# Altium schematic sheet DSP.SchDoc
size 400 x 260 mm; SheetNumber: 1; SheetTotal: 6
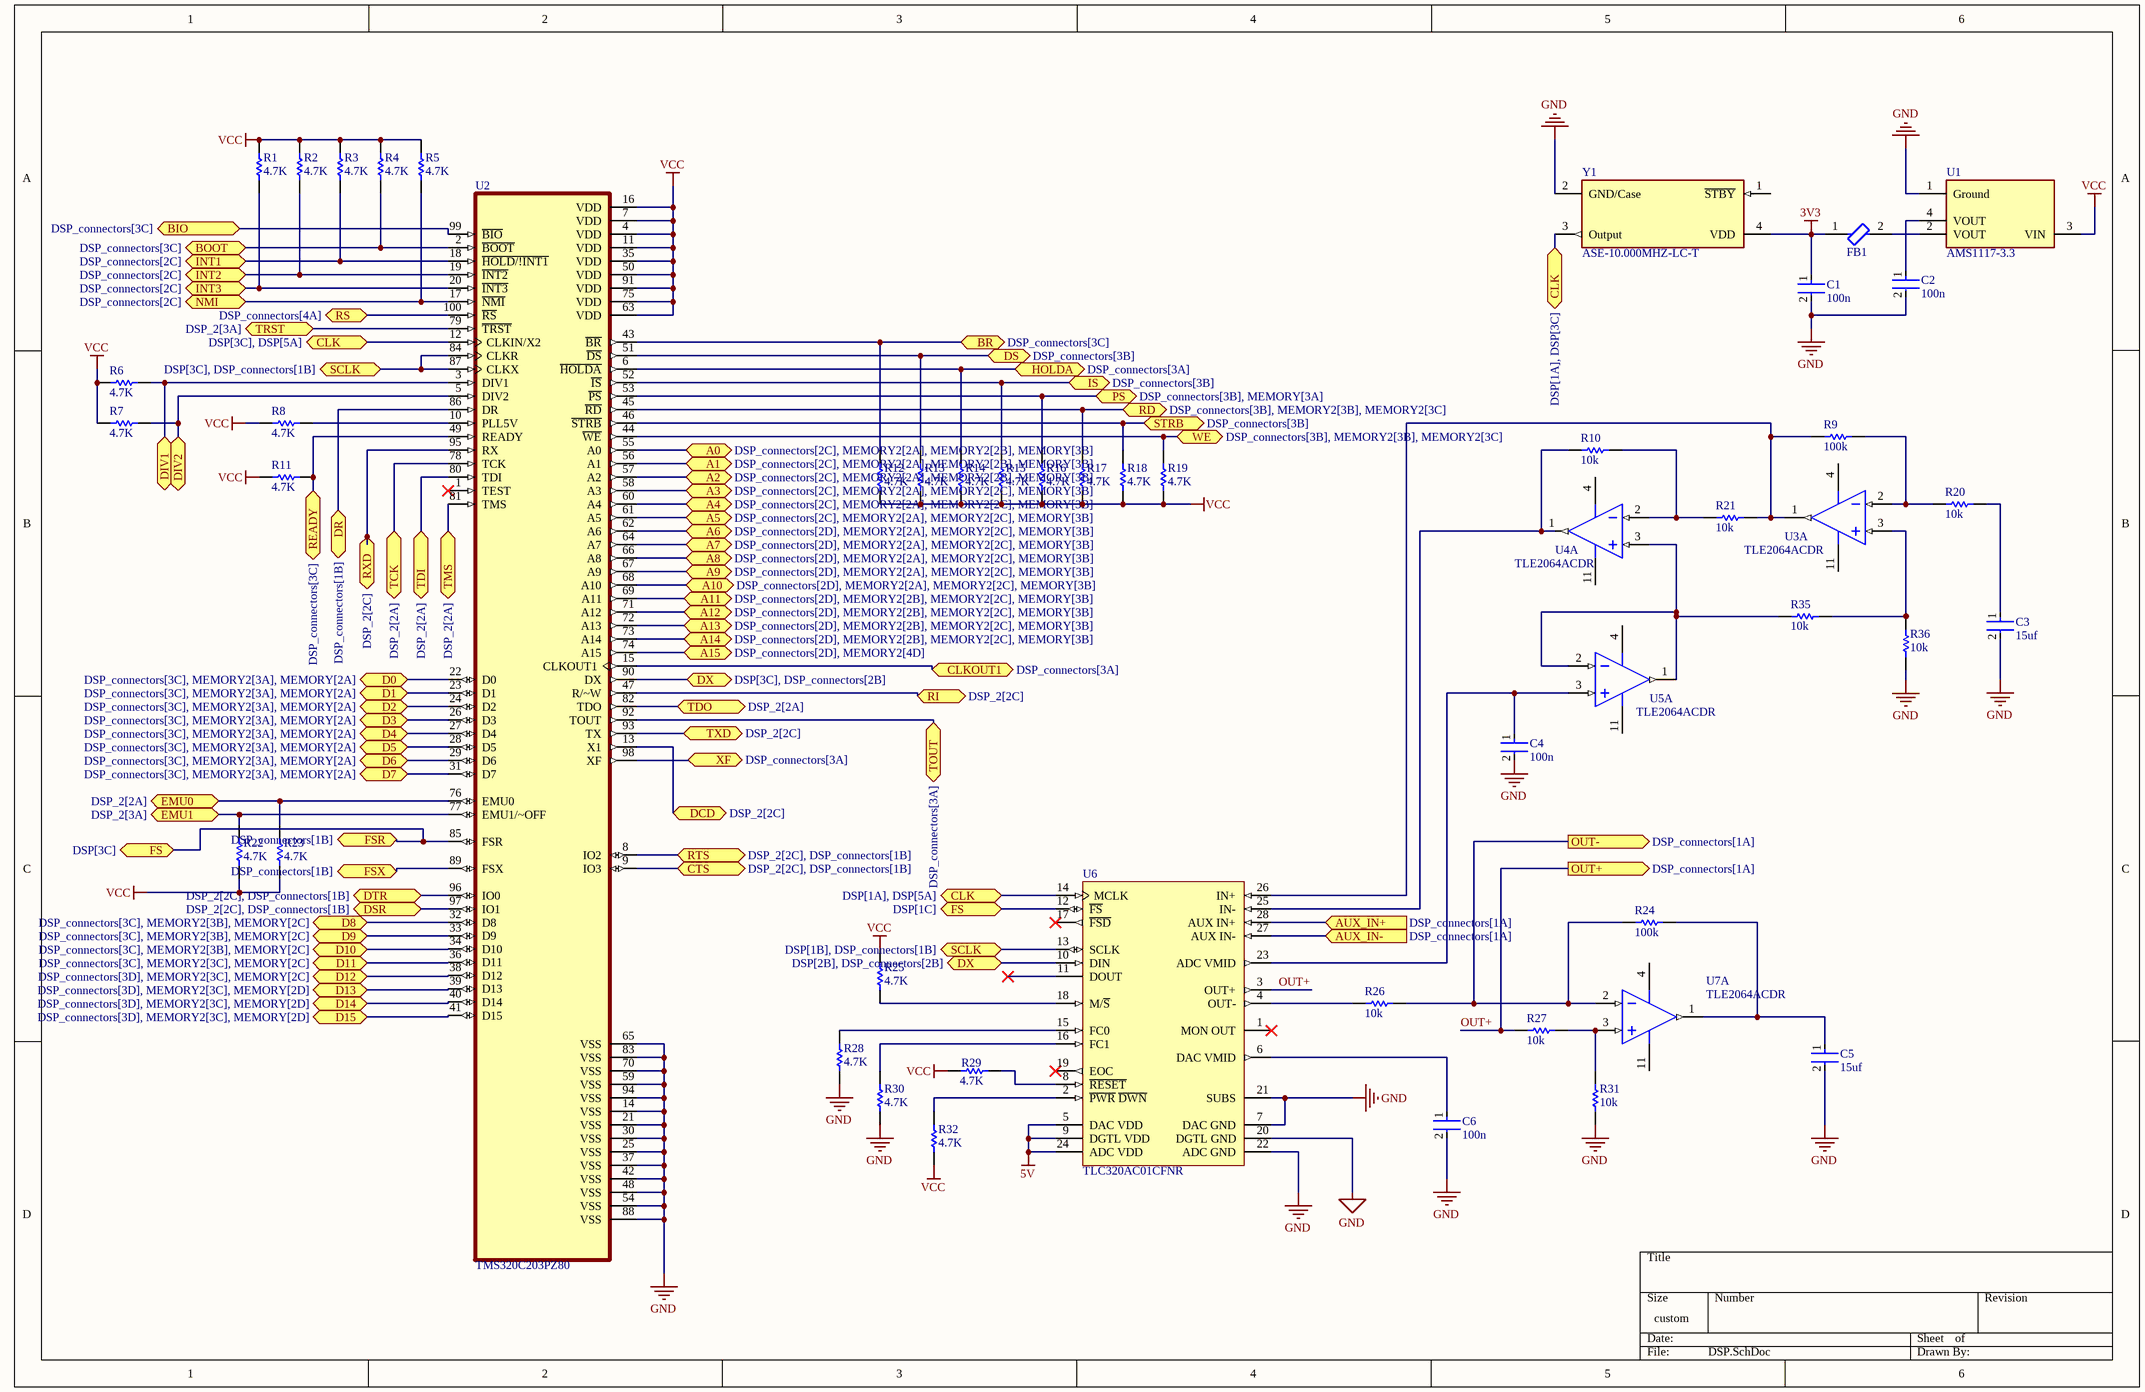
[diagram p0: DSP.SchDoc]

## Parts
C1  100n  [FP-CL10-IPC_C]
C2  100n  [FP-CL10-IPC_C]
C3  15uf  [FP-CL10-IPC_C]
C4  100n  [FP-CL10-IPC_C]
C5  15uf  [FP-CL10-IPC_C]
C6  100n  [FP-CL10-IPC_C]
FB1  BLM18KG121TN1D  [FP-BLM18-0_15-t0_6-d1_2-IPC_A]  (value not drawn)
R1  4.7K  [RESC2013X60X35ML10T20]
R2  4.7K  [RESC2013X60X35ML10T20]
R3  4.7K  [RESC2013X60X35ML10T20]
R4  4.7K  [RESC2013X60X35ML10T20]
R5  4.7K  [RESC2013X60X35ML10T20]
R6  4.7K  [RESC2013X60X35ML10T20]
R7  4.7K  [RESC2013X60X35ML10T20]
R8  4.7K  [RESC2013X60X35ML10T20]
R9  100k  [RESC2013X60X35ML10T20]
R10  10k  [RESC2013X60X35ML10T20]
R11  4.7K  [RESC2013X60X35ML10T20]
R12  4.7K  [RESC2013X60X35ML10T20]
R13  4.7K  [RESC2013X60X35ML10T20]
R14  4.7K  [RESC2013X60X35ML10T20]
R15  4.7K  [RESC2013X60X35ML10T20]
R16  4.7K  [RESC2013X60X35ML10T20]
R17  4.7K  [RESC2013X60X35ML10T20]
R18  4.7K  [RESC2013X60X35ML10T20]
R19  4.7K  [RESC2013X60X35ML10T20]
R20  10k  [RESC2013X60X35ML10T20]
R21  10k  [RESC2013X60X35ML10T20]
R22  4.7K  [RESC2013X60X35ML10T20]
R23  4.7K  [RESC2013X60X35ML10T20]
R24  100k  [RESC2013X60X35ML10T20]
R25  4.7K  [RESC2013X60X35ML10T20]
R26  10k  [RESC2013X60X35ML10T20]
R27  10k  [RESC2013X60X35ML10T20]
R28  4.7K  [RESC2013X60X35ML10T20]
R29  4.7K  [RESC2013X60X35ML10T20]
R30  4.7K  [RESC2013X60X35ML10T20]
R31  10k  [RESC2013X60X35ML10T20]
R32  4.7K  [RESC2013X60X35ML10T20]
R35  10k  [RESC2013X60X35ML10T20]
R36  10k  [RESC2013X60X35ML10T20]
U1  AMS1117-3.3  [FP-AMS1117-IPC_C]
U2  TMS320C203PZ80  [QFP50P1600X1600X160-100N]
U3  TLE2064ACDR  [D0014A_M]  (part A of 4)
U4  TLE2064ACDR  [D0014A_M]  (part A of 4)
U5  TLE2064ACDR  [D0014A_M]  (part A of 4)
U6  TLC320AC01CFNR  [FN0028A_L]
U7  TLE2064ACDR  [D0014A_M]  (part A of 4)
Y1  ASE-10.000MHZ-LC-T  [FP-ASE-MFG]

## Ports
A0 (bidir, see DSP_connectors[2C], MEMORY2[2A], MEMORY2[2B], MEMORY[3B]), A1 (bidir, see DSP_connectors[2C], MEMORY2[2A], MEMORY2[2B], MEMORY[3B]), A2 (bidir, see DSP_connectors[2C], MEMORY2[2A], MEMORY2[2B], MEMORY[3B]), A3 (bidir, see DSP_connectors[2C], MEMORY2[2A], MEMORY2[2C], MEMORY[3B]), A4 (bidir, see DSP_connectors[2C], MEMORY2[2A], MEMORY2[2C], MEMORY[3B]), A5 (bidir, see DSP_connectors[2C], MEMORY2[2A], MEMORY2[2C], MEMORY[3B]), A6 (bidir, see DSP_connectors[2D], MEMORY2[2A], MEMORY2[2C], MEMORY[3B]), A7 (bidir, see DSP_connectors[2D], MEMORY2[2A], MEMORY2[2C], MEMORY[3B]), A8 (bidir, see DSP_connectors[2D], MEMORY2[2A], MEMORY2[2C], MEMORY[3B]), A9 (bidir, see DSP_connectors[2D], MEMORY2[2A], MEMORY2[2C], MEMORY[3B]), A10 (bidir, see DSP_connectors[2D], MEMORY2[2A], MEMORY2[2C], MEMORY[3B]), A11 (bidir, see DSP_connectors[2D], MEMORY2[2B], MEMORY2[2C], MEMORY[3B]), A12 (bidir, see DSP_connectors[2D], MEMORY2[2B], MEMORY2[2C], MEMORY[3B]), A13 (bidir, see DSP_connectors[2D], MEMORY2[2B], MEMORY2[2C], MEMORY[3B]), A14 (bidir, see DSP_connectors[2D], MEMORY2[2B], MEMORY2[2C], MEMORY[3B]), A15 (bidir, see DSP_connectors[2D], MEMORY2[4D]), AUX_IN+ (in, see DSP_connectors[1A]), AUX_IN- (in, see DSP_connectors[1A]), BIO (bidir, see DSP_connectors[3C]), BOOT (bidir, see DSP_connectors[3C]), BR (bidir, see DSP_connectors[3C]), CLK (bidir, see DSP[1A], DSP[3C]), CLK (bidir, see DSP[1A], DSP[5A]), CLK (bidir, see DSP[3C], DSP[5A]), CLKOUT1 (bidir, see DSP_connectors[3A]), CTS (bidir, see DSP_2[2C], DSP_connectors[1B]), D0 (bidir, see DSP_connectors[3C], MEMORY2[3A], MEMORY[2A]), D1 (bidir, see DSP_connectors[3C], MEMORY2[3A], MEMORY[2A]), D2 (bidir, see DSP_connectors[3C], MEMORY2[3A], MEMORY[2A]), D3 (bidir, see DSP_connectors[3C], MEMORY2[3A], MEMORY[2A]), D4 (bidir, see DSP_connectors[3C], MEMORY2[3A], MEMORY[2A]), D5 (bidir, see DSP_connectors[3C], MEMORY2[3A], MEMORY[2A]), D6 (bidir, see DSP_connectors[3C], MEMORY2[3A], MEMORY[2A]), D7 (bidir, see DSP_connectors[3C], MEMORY2[3A], MEMORY[2A]), D8 (bidir, see DSP_connectors[3C], MEMORY2[3B], MEMORY[2C]), D9 (bidir, see DSP_connectors[3C], MEMORY2[3B], MEMORY[2C]), D10 (bidir, see DSP_connectors[3C], MEMORY2[3B], MEMORY[2C]), D11 (bidir, see DSP_connectors[3C], MEMORY2[3C], MEMORY[2C]), D12 (bidir, see DSP_connectors[3D], MEMORY2[3C], MEMORY[2C]), D13 (bidir, see DSP_connectors[3D], MEMORY2[3C], MEMORY[2D]), D14 (bidir, see DSP_connectors[3D], MEMORY2[3C], MEMORY[2D]), D15 (bidir, see DSP_connectors[3D], MEMORY2[3C], MEMORY[2D]), DCD (bidir, see DSP_2[2C]), DIV1 (bidir), DIV2 (bidir), DR (bidir, see DSP_connectors[1B]), DS (bidir, see DSP_connectors[3B]), DSR (bidir, see DSP_2[2C], DSP_connectors[1B]), DTR (bidir, see DSP_2[2C], DSP_connectors[1B]), DX (bidir, see DSP[2B], DSP_connectors[2B]), DX (bidir, see DSP[3C], DSP_connectors[2B]), EMU0 (bidir, see DSP_2[2A]), EMU1 (bidir, see DSP_2[3A]), FS (bidir, see DSP[1C]), FS (bidir, see DSP[3C]), FSR (bidir, see DSP_connectors[1B]), FSX (bidir, see DSP_connectors[1B]), HOLDA (bidir, see DSP_connectors[3A]), INT1 (bidir, see DSP_connectors[2C]), INT2 (bidir, see DSP_connectors[2C]), INT3 (bidir, see DSP_connectors[2C]), IS (bidir, see DSP_connectors[3B]), NMI (bidir, see DSP_connectors[2C]), OUT+ (out, see DSP_connectors[1A]), OUT- (out, see DSP_connectors[1A]), PS (bidir, see DSP_connectors[3B], MEMORY[3A]), RD (bidir, see DSP_connectors[3B], MEMORY2[3B], MEMORY2[3C]), READY (bidir, see DSP_connectors[3C]), RI (bidir, see DSP_2[2C]), RS (bidir, see DSP_connectors[4A]), RTS (bidir, see DSP_2[2C], DSP_connectors[1B]), RXD (bidir, see DSP_2[2C]), SCLK (bidir, see DSP[1B], DSP_connectors[1B]), SCLK (bidir, see DSP[3C], DSP_connectors[1B]), STRB (bidir, see DSP_connectors[3B]), TCK (bidir, see DSP_2[2A]), TDI (bidir, see DSP_2[2A]), TDO (bidir, see DSP_2[2A]), TMS (bidir, see DSP_2[2A]), TOUT (bidir, see DSP_connectors[3A]), TRST (bidir, see DSP_2[3A]), TXD (bidir, see DSP_2[2C]), WE (bidir, see DSP_connectors[3B], MEMORY2[3B], MEMORY2[3C]), XF (bidir, see DSP_connectors[3A])

## Nets
3V3: C1.1 FB1.1 Y1.4(VDD)
5V: U6.5(DAC_VDD) U6.9(DGTL_VDD) U6.24(ADC_VDD)
GND: C1.2 C2.2 C3.2 C4.2 C5.2 C6.2 R28.2 R30.1 R31.1 R36.2 U1.1(Ground) U2.14(VSS) U2.21(VSS) U2.25(VSS) U2.30(VSS) U2.37(VSS) U2.42(VSS) U2.48(VSS) U2.54(VSS) U2.59(VSS) U2.65(VSS) U2.70(VSS) U2.83(VSS) U2.88(VSS) U2.94(VSS) U6.7(DAC_GND) U6.20(DGTL_GND) U6.21(SUBS) U6.22(ADC_GND) Y1.2(GND/Case)
VCC: R1.2 R2.2 R3.2 R4.2 R5.2 R6.2 R7.2 R8.1 R11.1 R12.2 R13.2 R14.2 R15.2 R16.2 R17.2 R18.2 R19.2 R22.1 R23.1 R25.2 R29.2 R32.1 U1.3(VIN) U2.4(VDD) U2.7(VDD) U2.11(VDD) U2.16(VDD) U2.35(VDD) U2.50(VDD) U2.63(VDD) U2.75(VDD) U2.91(VDD)
A0: U2.55(A0) ; port A0
A1: U2.56(A1) ; port A1
A2: U2.57(A2) ; port A2
A3: U2.58(A3) ; port A3
A4: U2.60(A4) ; port A4
A5: U2.61(A5) ; port A5
A6: U2.62(A6) ; port A6
A7: U2.64(A7) ; port A7
A8: U2.66(A8) ; port A8
A9: U2.67(A9) ; port A9
A10: U2.68(A10) ; port A10
A11: U2.69(A11) ; port A11
A12: U2.71(A12) ; port A12
A13: U2.72(A13) ; port A13
A14: U2.73(A14) ; port A14
A15: U2.74(A15) ; port A15
AUX_IN+: U6.28(AUX_IN+) ; port AUX_IN+
AUX_IN-: U6.27(AUX_IN-) ; port AUX_IN-
BIO: U2.99(~{BIO}) ; port BIO
BOOT: R4.1 U2.2(~{BOOT}) ; port BOOT
BR: R12.1 U2.43(~{BR}) ; port BR
CLK: U2.12(CLKIN/X2) U6.14(MCLK) Y1.3(Output) ; port CLK
CLKOUT1: U2.15(CLKOUT1) ; port CLKOUT1
CTS: U2.9(IO3) ; port CTS
D0: U2.22(D0) ; port D0
D1: U2.23(D1) ; port D1
D2: U2.24(D2) ; port D2
D3: U2.26(D3) ; port D3
D4: U2.27(D4) ; port D4
D5: U2.28(D5) ; port D5
D6: U2.29(D6) ; port D6
D7: U2.31(D7) ; port D7
D8: U2.32(D8) ; port D8
D9: U2.33(D9) ; port D9
D10: U2.34(D10) ; port D10
D11: U2.36(D11) ; port D11
D12: U2.38(D12) ; port D12
D13: U2.39(D13) ; port D13
D14: U2.40(D14) ; port D14
D15: U2.41(D15) ; port D15
DCD: U2.13(X1) ; port DCD
DIV1: R6.1 U2.3(DIV1) ; port DIV1
DIV2: R7.1 U2.5(DIV2) ; port DIV2
DR: U2.86(DR) ; port DR
DS: R13.1 U2.51(~{DS}) ; port DS
DSR: U2.97(IO1) ; port DSR
DTR: U2.96(IO0) ; port DTR
DX: U2.90(DX) U6.10(DIN) ; port DX
EMU0: R23.2 U2.76(EMU0) ; port EMU0
EMU1: R22.2 U2.77(EMU1/~OFF) ; port EMU1
FS: U2.85(FSR) U6.12(~{FS}) ; port FS, port FSR
FSX: U2.89(FSX) ; port FSX
HOLDA: R14.1 U2.6(~{HOLDA}) ; port HOLDA
INT1: R3.1 U2.18(~{HOLD/!INT1}) ; port INT1
INT2: R2.1 U2.19(~{INT2}) ; port INT2
INT3: R1.1 U2.20(~{INT3}) ; port INT3
IS: R15.1 U2.52(~{IS}) ; port IS
NMI: R5.1 U2.17(~{NMI}) ; port NMI
OUT+: R27.2 U6.3(OUT+) ; port OUT+
OUT-: R24.2 R26.1 U7.2(IN1-) ; port OUT-
PS: R16.1 U2.53(~{PS}) ; port PS
RD: R17.1 U2.45(~{RD}) ; port RD
READY: R11.2 U2.49(READY) ; port READY
RI: U2.47(R/~W) ; port RI
RS: U2.100(~{RS}) ; port RS
RTS: U2.8(IO2) ; port RTS
RXD: U2.95(RX) ; port RXD
SCLK: U2.84(CLKR) U2.87(CLKX) U6.13(SCLK) ; port SCLK
STRB: R18.1 U2.46(~{STRB}) ; port STRB
TCK: U2.78(TCK) ; port TCK
TDI: U2.80(TDI) ; port TDI
TDO: U2.82(TDO) ; port TDO
TMS: U2.81(TMS) ; port TMS
TOUT: U2.92(TOUT) ; port TOUT
TRST: U2.79(~{TRST}) ; port TRST
TXD: U2.93(TX) ; port TXD
WE: R19.1 U2.44(~{WE}) ; port WE
XF: U2.98(XF) ; port XF
NetC2_1: C2.1 U1.4(VOUT)
NetC3_1: C3.1 R20.2
NetC4_1: C4.1 U5.3(IN1+) U6.23(ADC_VMID)
NetC5_1: C5.1 R24.1 U7.1(OUT1)
NetC6_1: C6.1 U6.6(DAC_VMID)
NetFB1_2: FB1.2 U1.2(VOUT)
NetR8_2: R8.2 U2.10(PLL5V)
NetR9_1: R9.1 R20.1 U3.2(IN1-)
NetR9_2: R9.2 R21.1 U3.1(OUT1) U6.26(IN+)
NetR10_1: R10.1 R21.2 U4.2(IN1-)
NetR10_2: R10.2 U4.1(OUT1) U6.25(IN-)
NetR25_1: R25.1 U6.18(M/~{S})
NetR26_2: R26.2 U6.4(OUT-)
NetR27_1: R27.1 R31.2 U7.3(IN1+)
NetR28_1: R28.1 U6.15(FC0)
NetR29_1: R29.1 U6.8(~{RESET})
NetR30_2: R30.2 U6.16(FC1)
NetR32_2: R32.2 U6.2(~{PWR}_~{DWN})
NetR35_1: R35.1 R36.1 U3.3(IN1+)
NetR35_2: R35.2 U4.3(IN1+) U5.1(OUT1) U5.2(IN1-)

Not connected (* = marked no-connect by the designer): U2 1(TEST)*; U3 4(VCC+) 11(VCC-); U4 4(VCC+) 11(VCC-); U5 4(VCC+) 11(VCC-); U6 1(MON_OUT)* 11(DOUT)* 17(~{FSD})* 19(EOC)*; U7 4(VCC+) 11(VCC-); Y1 1(~{STBY})

## Library data of the parts
C1-C6 = CMP-13271-003017-1: Cap Ceramic 4.7uF 10V X5R ±10% Pad SMD 0603 +85°C T/R; Capacitance: 4.7uF; Case/Package: 0603; Packaging: Tape and Reel; Width: 0.031inch; Contact Plating: Tin; Thickness: 0.035inch; Package Quantity: 1; Voltage Rating: 10V; Case Code (Metric): 1608; Case Code (Imperial): 0603; Depth: 0.8mm; Height: 0.8mm; Tolerance: 10%; Max Operating Temperature: 85°C; Length: 1.6mm; Dielectric: X5R; Mount: Surface Mount; Radiation Hardening: No; Min Operating Temperature: -55°C
FB1 = CMP-0686-00554-8: FERRITE BEAD 120 OHM 0603 1LN; Max Current Rating: 3A; DC Resistance (DCR): 30mR; Impedance: 120R; Number of Lines: 1; Test Frequency: 100MHz; Tolerance: 25%; Package Quantity: 4000; Min Operating Temperature: -55°C; Termination: SMD/SMT; REACH SVHC: No SVHC; Core Material: Ferrite; Material: Ferrite; Current Rating: 3A; Height: 0.8mm; Number of Pins: 2; Case/Package: 0603; Case Code (Imperial): 0603; Series: BLM18K; Packaging: Tape and Reel; Inductor Type: FERRITE BEAD; Lead Free: Lead Free; Width: 0.8mm; Case Code (Metric): 1608; Number of Circuits: 1; Max DC Current: 3A; Depth: 0.95mm; Max Operating Temperature: 125°C; Length: 1.6mm; RoHS Compliant: Yes
R1-R32 R35 R36 = CMP-2100-03673-1: Chip Resistor, 0 Ohm, Jumper, +/- 5%, 0.125 W, -55 to 155 degC, 0805 (2012 Metric), RoHS, Tape and Reel; Manufacturer: Yageo; Power Rating: 125mW; Resistance: 0mOhm; Voltage Rating (DC): 150V; Temperature Coefficient: 200ppm/degreesC; Height: 0.5mm; Depth: 1.25mm; Case Code (Imperial): 0805; Lead Free: LeadFree; Military Standard: Not; Package Description: 2-Pin Surface Mounted Device, Body 2 x 1.25 mm; Case Code (Metric): 2012; Composition: ThickFilm; Voltage Rating: 150V; Manufacturer URL: http://www.yageo.com/; Packaging: TapeandReel; Package Reference: 0805; REACH SVHC: Unknown; Tolerance: 5%; Case/Package: 0805; Max Operating Temperature: 155degC; Number of Pins: 2; Min Operating Temperature: -55degC; RoHSCompliant: true; Length: 2mm; Datasheet URL: http://www.yageo.com/NewPortal/yageodocoutput?fileName=/pdf/R-Chip/PYu-RC_Group_51_RoHS_L_5.pdf; Termination: SMD/SMT; Radiation Hardening: No; Width: 1.25mm; Contact Plating: Tin; Datasheet Version: Rev. 5, 10/2016
U1 = CMP-209535-000001-1: LDO Voltage Regulators 1A, 3.3V; Manufacturer: Advanced Monolithic Systems; Dropout Voltage: 1.1V; Output Type: Fixed; Nominal Supply Current: 5mA; Max Power Dissipation: 1.2W; Max Supply Voltage: 15V; Number Of Outputs: 1; Standoff Height: 0.64mm; Max Junction Temp: +125°C; Height: 1.8mm; Package: AMS1117; Device Class L2: Power Management ICs; ComponentLink2Description: Datasheet; ComponentLink2URL: http://www.advanced-monolithic.com/pdf/ds1117.pdf; Category: IC; RoHS: TRUE; Automotive: No; Device Class L1: Integrated Circuits (ICs); Output Current: 1A; Device Class L3: Voltage Regulators - Linear; Temperature: -40°C to +125°C; Output Voltage: 3.3V; Manufacturer Part Number: AMS1117-3.3; Temperature Range Low: -40°C; Octopart: https://octopart.com/ams1117-3.3-advanced+monolithic+systems-25899300; Lead Free: Yes; Ipc Land Pattern Name: SOT229P700X180-4; Temperature Range High: +125°C
U3-U5 U7 = CMP-0272-01885-3: Excalibur JFET-Input High-Output-Drive uPower Quad Operational Amplifier, 7 to 36 V, 0 to70 degC, 14-pin SOIC (D14), Green (RoHS & no Sb/Br); Manufacturer: Texas Instruments; IIB(Max)(pA): 2000; Vio (25C)(Max)(mV): 6; Total Supply Voltage(Min)(+5V is 5, +/-5V is 10): 7; Rating: Catalog; Sub Family: High Supply Voltage Amplifier (>=30V), Low Power Amp (<=500uA), Precision Amplifier; CMRR(Min)(dB): 65; Packing: LARGE T&R; Total Supply Voltage(Max)(+5V is 5, +/-5V is 10): 36; Number of Channels: 4; Iq per channel(Max)(mA): 0.325; Slew Rate(Typ)(V/us): 3.4; GBW(Typ)(MHz): 1.8; Code_JEDEC: MS-012; Eco-Plan: Green (RoHS & no Sb/Br); ComponentLink2Description: Datasheet; PackageVersion: 4040047-5/M, 06/2011; ComponentLink3Description: Package Specification; Offset Drift(Typ)(uV/C): 6; PackageDescription: 14-Pin Plastic Small Outline, Body 8.65 x 3.9 mm, Pitch 1.27 mm; Mounting Technology: Surface Mount; PackageReference: D0014A; ComponentLink2URL: http://www.ti.com/lit/ds/symlink/tle2064a.pdf; DatasheetVersion: SLOS193B; ComponentLink3URL: http://www.ti.com/lit/ml/mpds177g/mpds177g.pdf; PartNumber: TLE2064ACDR; ComponentLink1Description: Manufacturer URL; ComponentLink1URL: http://www.ti.com/
U6 = CMP-0331-00025-2: Single Channel CODEC-Bandwidth Independent of Sampling Rate, 0 to 70 degC, 28-pin PLCC (FN), Green (RoHS & no Sb/Br); Manufacturer: Texas Instruments; Sampling Rate (Max) (kHz): 25; Line Powered: TRUE; PackageDescription: 28-Pin Plastic J-Leaded Chip Carrier, 1.27 mm Pitch; DatasheetVersion: SLAS057D; PackageVersion: revB, Mar-1995; ComponentLink1Description: Datasheet; ComponentLink1URL: http://www.ti.com/general/docs/lit/getliterature.tsp?genericPartNumber=TLC320AC01&fileType=pdf; Mounting Technology: Surface Mount; Code_JEDEC: MS-018; PartNumber: TLC320AC01CFNR; PackageReference: FN0028A
Y1 = CMP-27762-014276-1: XTAL Oscillator 10MHz ±50ppm CMOS 3.3V 4-SMD 3.2mm x 2.5mm; Max Supply Voltage: 3.465V; Max Supply Current: 7mA; Load Capacitance: 15pF; Min Supply Voltage: 3.135V; Number of Pins: 4; Case/Package: SMD/SMT; Lead Free: Lead Free; Depth: 2.5mm; Radiation Hardening: No; Width: 0.098inch; Length: 3.2mm; Termination: SMD/SMT; Min Operating Temperature: -40°C; Operating Supply Voltage: 3.3V; Series: ASE; Packaging: Tape and Reel; REACH SVHC: No SVHC; Mount: Surface Mount; Frequency: 10MHz; Package Quantity: 1000; Max Operating Temperature: 85°C; Operating Frequency: 10 MHz; Height: 0.047inch; Frequency Stability: 50ppm
U2 = TMS320C203PZ80: Package: None; Price: None; Value: *; MP: TMS320C203PZ80; Availability: Unavailable